# Altium schematic sheet IFAT6_QFP.SchDoc
size 457 x 254 mm
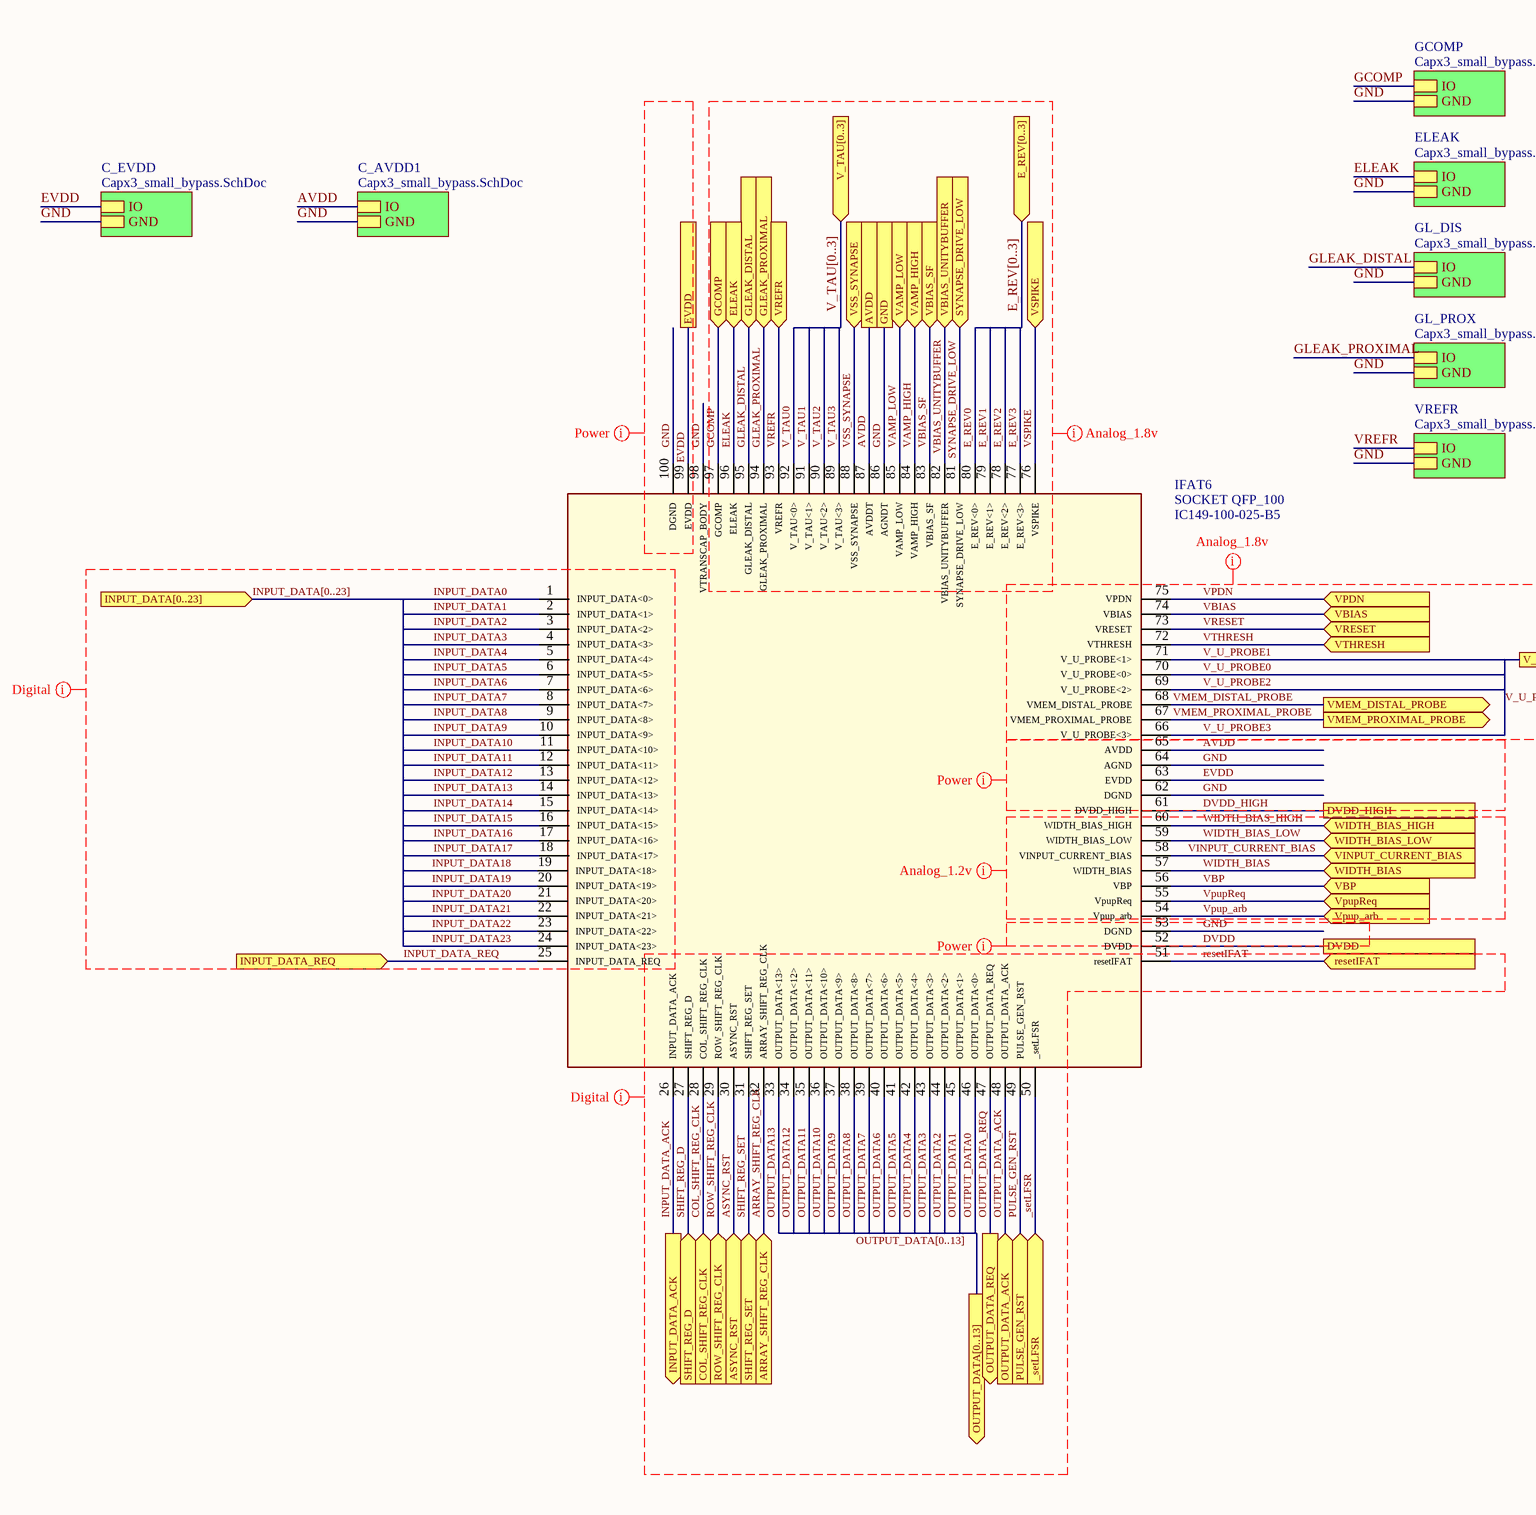
[diagram p0: IFAT6_QFP.SchDoc, left]
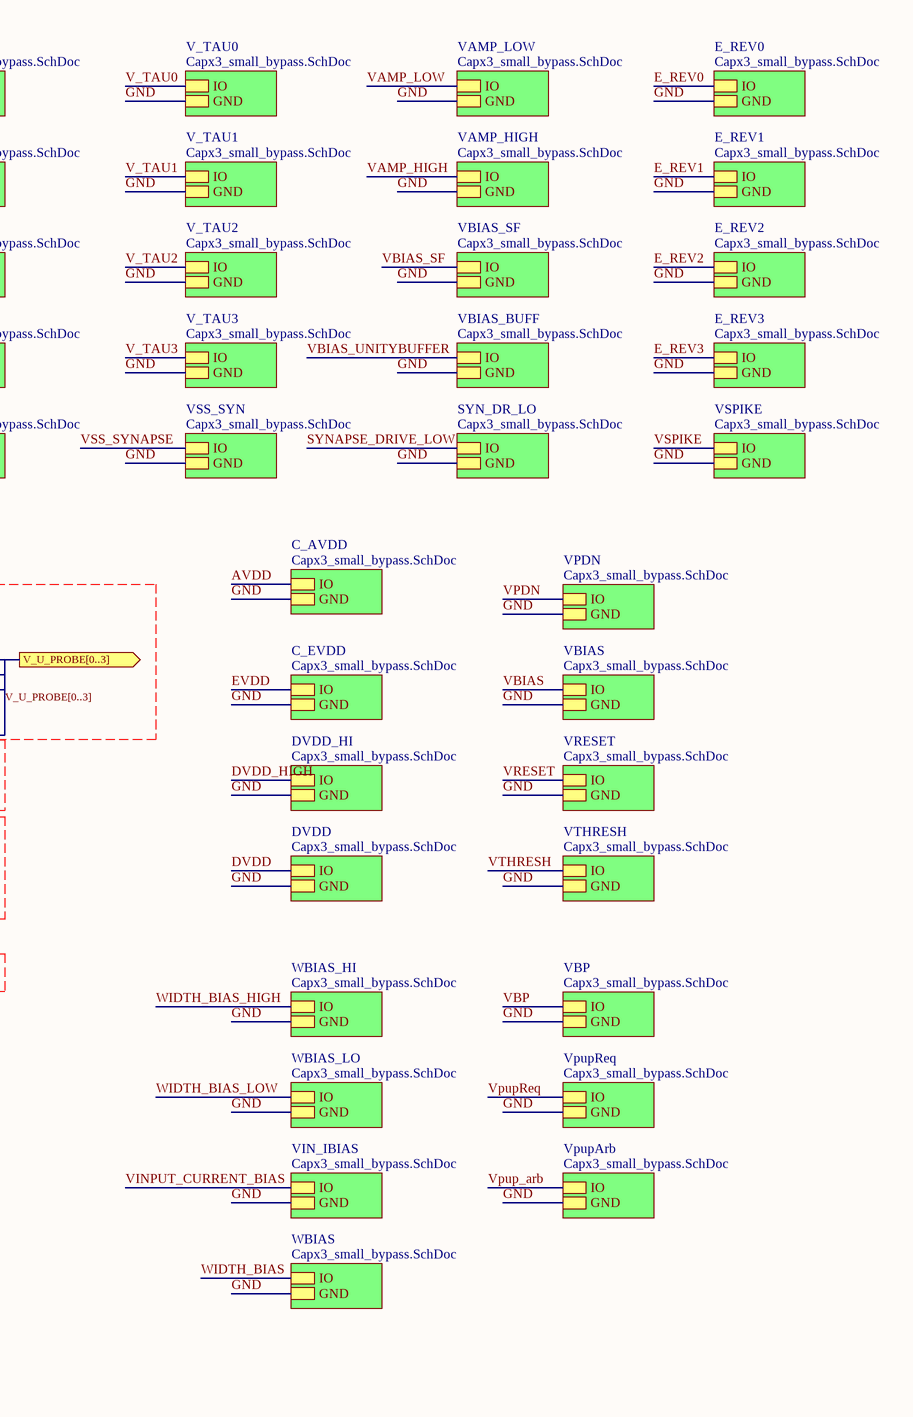
[diagram p1: IFAT6_QFP.SchDoc, right]

## Parts
IFAT6  SOCKET QFP_100  Manufacturer_Part_Number: IC149-100-025-B5  [YAMAICHI_IC149-100-025-B5]

## Sub-sheets
C_AVDD = Capx3_small_bypass.SchDoc: IO, GND
C_AVDD1 = Capx3_small_bypass.SchDoc: IO, GND
C_EVDD = Capx3_small_bypass.SchDoc: IO, GND
C_EVDD = Capx3_small_bypass.SchDoc: IO, GND
DVDD = Capx3_small_bypass.SchDoc: IO, GND
DVDD_HI = Capx3_small_bypass.SchDoc: IO, GND
E_REV0 = Capx3_small_bypass.SchDoc: IO, GND
E_REV1 = Capx3_small_bypass.SchDoc: IO, GND
E_REV2 = Capx3_small_bypass.SchDoc: IO, GND
E_REV3 = Capx3_small_bypass.SchDoc: IO, GND
ELEAK = Capx3_small_bypass.SchDoc: IO, GND
GCOMP = Capx3_small_bypass.SchDoc: IO, GND
GL_DIS = Capx3_small_bypass.SchDoc: IO, GND
GL_PROX = Capx3_small_bypass.SchDoc: IO, GND
SYN_DR_LO = Capx3_small_bypass.SchDoc: IO, GND
V_TAU0 = Capx3_small_bypass.SchDoc: IO, GND
V_TAU1 = Capx3_small_bypass.SchDoc: IO, GND
V_TAU2 = Capx3_small_bypass.SchDoc: IO, GND
V_TAU3 = Capx3_small_bypass.SchDoc: IO, GND
VAMP_HIGH = Capx3_small_bypass.SchDoc: IO, GND
VAMP_LOW = Capx3_small_bypass.SchDoc: IO, GND
VBIAS = Capx3_small_bypass.SchDoc: IO, GND
VBIAS_BUFF = Capx3_small_bypass.SchDoc: IO, GND
VBIAS_SF = Capx3_small_bypass.SchDoc: IO, GND
VBP = Capx3_small_bypass.SchDoc: IO, GND
VIN_IBIAS = Capx3_small_bypass.SchDoc: IO, GND
VPDN = Capx3_small_bypass.SchDoc: IO, GND
VpupArb = Capx3_small_bypass.SchDoc: IO, GND
VpupReq = Capx3_small_bypass.SchDoc: IO, GND
VREFR = Capx3_small_bypass.SchDoc: IO, GND
VRESET = Capx3_small_bypass.SchDoc: IO, GND
VSPIKE = Capx3_small_bypass.SchDoc: IO, GND
VSS_SYN = Capx3_small_bypass.SchDoc: IO, GND
VTHRESH = Capx3_small_bypass.SchDoc: IO, GND
WBIAS = Capx3_small_bypass.SchDoc: IO, GND
WBIAS_HI = Capx3_small_bypass.SchDoc: IO, GND
WBIAS_LO = Capx3_small_bypass.SchDoc: IO, GND

## Ports
_setLFSR (in), ARRAY_SHIFT_REG_CLK (in), ASYNC_RST (in), AVDD, COL_SHIFT_REG_CLK (in), DVDD, DVDD_HIGH, E_REV[0..3] (in), ELEAK (in), EVDD, GCOMP (in), GLEAK_DISTAL (in), GLEAK_PROXIMAL (in), GND, INPUT_DATA[0..23] (in), INPUT_DATA_ACK (out), INPUT_DATA_REQ (in), OUTPUT_DATA[0..13] (out), OUTPUT_DATA_ACK (in), OUTPUT_DATA_REQ (out), PULSE_GEN_RST (in), resetIFAT (in), ROW_SHIFT_REG_CLK (in), SHIFT_REG_D (in), SHIFT_REG_SET (in), SYNAPSE_DRIVE_LOW (in), V_TAU[0..3] (in), V_U_PROBE[0..3] (out), VAMP_HIGH (in), VAMP_LOW (in), VBIAS (in), VBIAS_SF (in), VBIAS_UNITYBUFFER (in), VBP (in), VINPUT_CURRENT_BIAS (in), VMEM_DISTAL_PROBE (out), VMEM_PROXIMAL_PROBE (out), VPDN (in), Vpup_arb (in), VpupReq (in), VREFR (in), VRESET (in), VSPIKE (in), VSS_SYNAPSE (in), VTHRESH (in), WIDTH_BIAS (in), WIDTH_BIAS_HIGH (in), WIDTH_BIAS_LOW (in)

## Nets
_setLFSR: IFAT6.50(_setLFSR) ; port _setLFSR
ARRAY_SHIFT_REG_CLK: IFAT6.32(ARRAY_SHIFT_REG_CLK) ; port ARRAY_SHIFT_REG_CLK
ASYNC_RST: IFAT6.30(ASYNC_RST) ; port ASYNC_RST
AVDD: IFAT6.65(AVDD) IFAT6.87(AVDDT) ; port AVDD, sheet C_AVDD/IO, sheet C_AVDD1/IO
COL_SHIFT_REG_CLK: IFAT6.28(COL_SHIFT_REG_CLK) ; port COL_SHIFT_REG_CLK
DVDD: IFAT6.52(DVDD) ; port DVDD, sheet DVDD/IO
DVDD_HIGH: IFAT6.61(DVDD_HIGH) ; port DVDD_HIGH, sheet DVDD_HI/IO
E_REV0: IFAT6.80(E_REV<0>) ; sheet E_REV0/IO
E_REV1: IFAT6.79(E_REV<1>) ; sheet E_REV1/IO
E_REV2: IFAT6.78(E_REV<2>) ; sheet E_REV2/IO
E_REV3: IFAT6.77(E_REV<3>) ; sheet E_REV3/IO
ELEAK: IFAT6.96(ELEAK) ; port ELEAK, sheet ELEAK/IO
EVDD: IFAT6.63(EVDD) IFAT6.99(EVDD) ; port EVDD, sheet C_EVDD/IO, sheet C_EVDD/IO
GCOMP: IFAT6.97(GCOMP) ; port GCOMP, sheet GCOMP/IO
GLEAK_DISTAL: IFAT6.95(GLEAK_DISTAL) ; port GLEAK_DISTAL, sheet GL_DIS/IO
GLEAK_PROXIMAL: IFAT6.94(GLEAK_PROXIMAL) ; port GLEAK_PROXIMAL, sheet GL_PROX/IO
GND: IFAT6.53(DGND) IFAT6.62(DGND) IFAT6.64(AGND) IFAT6.86(AGNDT) IFAT6.98(VTRANSCAP_BODY) IFAT6.100(DGND) ; port GND, sheet C_EVDD/GND, sheet DVDD_HI/GND, sheet DVDD/GND, sheet VSS_SYN/GND, sheet VAMP_LOW/GND, sheet C_EVDD/GND, sheet GCOMP/GND, sheet ELEAK/GND, sheet C_AVDD/GND, sheet GL_DIS/GND, sheet GL_PROX/GND, sheet V_TAU3/GND, sheet V_TAU2/GND, sheet C_AVDD1/GND, sheet V_TAU0/GND, sheet VREFR/GND, sheet V_TAU1/GND, sheet VAMP_HIGH/GND, sheet VBIAS_BUFF/GND, sheet SYN_DR_LO/GND, sheet VBIAS_SF/GND, sheet E_REV0/GND, sheet E_REV1/GND, sheet E_REV2/GND, sheet E_REV3/GND, sheet VSPIKE/GND, sheet WBIAS/GND, sheet VPDN/GND, sheet VBIAS/GND, sheet VRESET/GND, sheet VTHRESH/GND, sheet VIN_IBIAS/GND, sheet WBIAS_HI/GND, sheet WBIAS_LO/GND, sheet VBP/GND, sheet VpupReq/GND, sheet VpupArb/GND
INPUT_DATA0: IFAT6.1(INPUT_DATA<0>)
INPUT_DATA1: IFAT6.2(INPUT_DATA<1>)
INPUT_DATA2: IFAT6.3(INPUT_DATA<2>)
INPUT_DATA3: IFAT6.4(INPUT_DATA<3>)
INPUT_DATA4: IFAT6.5(INPUT_DATA<4>)
INPUT_DATA5: IFAT6.6(INPUT_DATA<5>)
INPUT_DATA6: IFAT6.7(INPUT_DATA<6>)
INPUT_DATA7: IFAT6.8(INPUT_DATA<7>)
INPUT_DATA8: IFAT6.9(INPUT_DATA<8>)
INPUT_DATA9: IFAT6.10(INPUT_DATA<9>)
INPUT_DATA10: IFAT6.11(INPUT_DATA<10>)
INPUT_DATA11: IFAT6.12(INPUT_DATA<11>)
INPUT_DATA12: IFAT6.13(INPUT_DATA<12>)
INPUT_DATA13: IFAT6.14(INPUT_DATA<13>)
INPUT_DATA14: IFAT6.15(INPUT_DATA<14>)
INPUT_DATA15: IFAT6.16(INPUT_DATA<15>)
INPUT_DATA16: IFAT6.17(INPUT_DATA<16>)
INPUT_DATA17: IFAT6.18(INPUT_DATA<17>)
INPUT_DATA18: IFAT6.19(INPUT_DATA<18>)
INPUT_DATA19: IFAT6.20(INPUT_DATA<19>)
INPUT_DATA20: IFAT6.21(INPUT_DATA<20>)
INPUT_DATA21: IFAT6.22(INPUT_DATA<21>)
INPUT_DATA22: IFAT6.23(INPUT_DATA<22>)
INPUT_DATA23: IFAT6.24(INPUT_DATA<23>)
INPUT_DATA_ACK: IFAT6.26(INPUT_DATA_ACK) ; port INPUT_DATA_ACK
INPUT_DATA_REQ: IFAT6.25(INPUT_DATA_REQ) ; port INPUT_DATA_REQ
OUTPUT_DATA0: IFAT6.46(OUTPUT_DATA<0>)
OUTPUT_DATA1: IFAT6.45(OUTPUT_DATA<1>)
OUTPUT_DATA2: IFAT6.44(OUTPUT_DATA<2>)
OUTPUT_DATA3: IFAT6.43(OUTPUT_DATA<3>)
OUTPUT_DATA4: IFAT6.42(OUTPUT_DATA<4>)
OUTPUT_DATA5: IFAT6.41(OUTPUT_DATA<5>)
OUTPUT_DATA6: IFAT6.40(OUTPUT_DATA<6>)
OUTPUT_DATA7: IFAT6.39(OUTPUT_DATA<7>)
OUTPUT_DATA8: IFAT6.38(OUTPUT_DATA<8>)
OUTPUT_DATA9: IFAT6.37(OUTPUT_DATA<9>)
OUTPUT_DATA10: IFAT6.36(OUTPUT_DATA<10>)
OUTPUT_DATA11: IFAT6.35(OUTPUT_DATA<11>)
OUTPUT_DATA12: IFAT6.34(OUTPUT_DATA<12>)
OUTPUT_DATA13: IFAT6.33(OUTPUT_DATA<13>)
OUTPUT_DATA_ACK: IFAT6.48(OUTPUT_DATA_ACK) ; port OUTPUT_DATA_ACK
OUTPUT_DATA_REQ: IFAT6.47(OUTPUT_DATA_REQ) ; port OUTPUT_DATA_REQ
PULSE_GEN_RST: IFAT6.49(PULSE_GEN_RST) ; port PULSE_GEN_RST
resetIFAT: IFAT6.51(resetIFAT) ; port resetIFAT
ROW_SHIFT_REG_CLK: IFAT6.29(ROW_SHIFT_REG_CLK) ; port ROW_SHIFT_REG_CLK
SHIFT_REG_D: IFAT6.27(SHIFT_REG_D) ; port SHIFT_REG_D
SHIFT_REG_SET: IFAT6.31(SHIFT_REG_SET) ; port SHIFT_REG_SET
SYNAPSE_DRIVE_LOW: IFAT6.81(SYNAPSE_DRIVE_LOW) ; port SYNAPSE_DRIVE_LOW, sheet SYN_DR_LO/IO
V_TAU0: IFAT6.92(V_TAU<0>) ; sheet V_TAU0/IO
V_TAU1: IFAT6.91(V_TAU<1>) ; sheet V_TAU1/IO
V_TAU2: IFAT6.90(V_TAU<2>) ; sheet V_TAU2/IO
V_TAU3: IFAT6.89(V_TAU<3>) ; sheet V_TAU3/IO
V_U_PROBE0: IFAT6.70(V_U_PROBE<0>)
V_U_PROBE1: IFAT6.71(V_U_PROBE<1>)
V_U_PROBE2: IFAT6.69(V_U_PROBE<2>)
V_U_PROBE3: IFAT6.66(V_U_PROBE<3>)
VAMP_HIGH: IFAT6.84(VAMP_HIGH) ; port VAMP_HIGH, sheet VAMP_HIGH/IO
VAMP_LOW: IFAT6.85(VAMP_LOW) ; port VAMP_LOW, sheet VAMP_LOW/IO
VBIAS: IFAT6.74(VBIAS) ; port VBIAS, sheet VBIAS/IO
VBIAS_SF: IFAT6.83(VBIAS_SF) ; port VBIAS_SF, sheet VBIAS_SF/IO
VBIAS_UNITYBUFFER: IFAT6.82(VBIAS_UNITYBUFFER) ; port VBIAS_UNITYBUFFER, sheet VBIAS_BUFF/IO
VBP: IFAT6.56(VBP) ; port VBP, sheet VBP/IO
VINPUT_CURRENT_BIAS: IFAT6.58(VINPUT_CURRENT_BIAS) ; port VINPUT_CURRENT_BIAS, sheet VIN_IBIAS/IO
VMEM_DISTAL_PROBE: IFAT6.68(VMEM_DISTAL_PROBE) ; port VMEM_DISTAL_PROBE
VMEM_PROXIMAL_PROBE: IFAT6.67(VMEM_PROXIMAL_PROBE) ; port VMEM_PROXIMAL_PROBE
VPDN: IFAT6.75(VPDN) ; port VPDN, sheet VPDN/IO
Vpup_arb: IFAT6.54(Vpup_arb) ; port Vpup_arb, sheet VpupArb/IO
VpupReq: IFAT6.55(VpupReq) ; port VpupReq, sheet VpupReq/IO
VREFR: IFAT6.93(VREFR) ; port VREFR, sheet VREFR/IO
VRESET: IFAT6.73(VRESET) ; port VRESET, sheet VRESET/IO
VSPIKE: IFAT6.76(VSPIKE) ; port VSPIKE, sheet VSPIKE/IO
VSS_SYNAPSE: IFAT6.88(VSS_SYNAPSE) ; port VSS_SYNAPSE, sheet VSS_SYN/IO
VTHRESH: IFAT6.72(VTHRESH) ; port VTHRESH, sheet VTHRESH/IO
WIDTH_BIAS: IFAT6.57(WIDTH_BIAS) ; port WIDTH_BIAS, sheet WBIAS/IO
WIDTH_BIAS_HIGH: IFAT6.60(WIDTH_BIAS_HIGH) ; port WIDTH_BIAS_HIGH, sheet WBIAS_HI/IO
WIDTH_BIAS_LOW: IFAT6.59(WIDTH_BIAS_LOW) ; port WIDTH_BIAS_LOW, sheet WBIAS_LO/IO

## Buses and harness runs
bus E_REV[0..3] = port E_REV[0..3]
bus INPUT_DATA[0..23] = port INPUT_DATA[0..23]
bus OUTPUT_DATA[0..13] = port OUTPUT_DATA[0..13]
bus V_TAU[0..3] = port V_TAU[0..3]
bus V_U_PROBE[0..3] = port V_U_PROBE[0..3]

## Layout directives
mark named Digital: _setLFSR, ARRAY_SHIFT_REG_CLK, ASYNC_RST, COL_SHIFT_REG_CLK, INPUT_DATA0, INPUT_DATA1, INPUT_DATA2, INPUT_DATA3, INPUT_DATA4, INPUT_DATA5, INPUT_DATA6, INPUT_DATA7, INPUT_DATA8, INPUT_DATA9, INPUT_DATA10, INPUT_DATA11, INPUT_DATA12, INPUT_DATA13, INPUT_DATA14, INPUT_DATA15, INPUT_DATA16, INPUT_DATA17, INPUT_DATA18, INPUT_DATA19, INPUT_DATA20, INPUT_DATA21, INPUT_DATA22, INPUT_DATA23, INPUT_DATA[0..23], INPUT_DATA_ACK, INPUT_DATA_REQ, OUTPUT_DATA0, OUTPUT_DATA1, OUTPUT_DATA2, OUTPUT_DATA3, OUTPUT_DATA4, OUTPUT_DATA5, OUTPUT_DATA6, OUTPUT_DATA7, OUTPUT_DATA8, OUTPUT_DATA9, OUTPUT_DATA10, OUTPUT_DATA11, OUTPUT_DATA12, OUTPUT_DATA13, OUTPUT_DATA[0..13], OUTPUT_DATA_ACK, OUTPUT_DATA_REQ, PULSE_GEN_RST, resetIFAT, ROW_SHIFT_REG_CLK, SHIFT_REG_D, SHIFT_REG_SET
mark named Analog_1.8v: AVDD, E_REV0, E_REV1, E_REV2, E_REV3, E_REV[0..3], ELEAK, GCOMP, GLEAK_DISTAL, GLEAK_PROXIMAL, GND, SYNAPSE_DRIVE_LOW, V_TAU0, V_TAU1, V_TAU2, V_TAU3, V_TAU[0..3], V_U_PROBE0, V_U_PROBE1, V_U_PROBE2, V_U_PROBE3, V_U_PROBE[0..3], VAMP_HIGH, VAMP_LOW, VBIAS, VBIAS_SF, VBIAS_UNITYBUFFER, VMEM_DISTAL_PROBE, VMEM_PROXIMAL_PROBE, VPDN, VREFR, VRESET, VSPIKE, VSS_SYNAPSE, VTHRESH
mark named Analog_1.2v: VBP, VINPUT_CURRENT_BIAS, Vpup_arb, VpupReq, WIDTH_BIAS, WIDTH_BIAS_HIGH, WIDTH_BIAS_LOW
mark named Power: AVDD, DVDD, DVDD_HIGH, EVDD, GND

## Library data of the parts
IFAT6 = SOCKET QFP_100: 100 pin QFP; Manufacturer_Name: Yamaichi Electronics; Datasheet Link: https://www.mouser.com/datasheet/2/448/Yamaichi_Electronics_08162018_IC149-100-x25-x5x_L-1391528.pdf; Mouser Price/Stock: https://www.mouser.com/ProductDetail/Yamaichi-Electronics/IC149-100-025-B5?qs=nO3wRANIIvnwx1%2FO7RgPQA%3D%3D&countrycode=US&currencycode=USD; Mouser Part Number: 945-IC149-100-025-B5